# EAGLE design DRC10_2P4X1P65.pac (EAGLE 9.6.2)
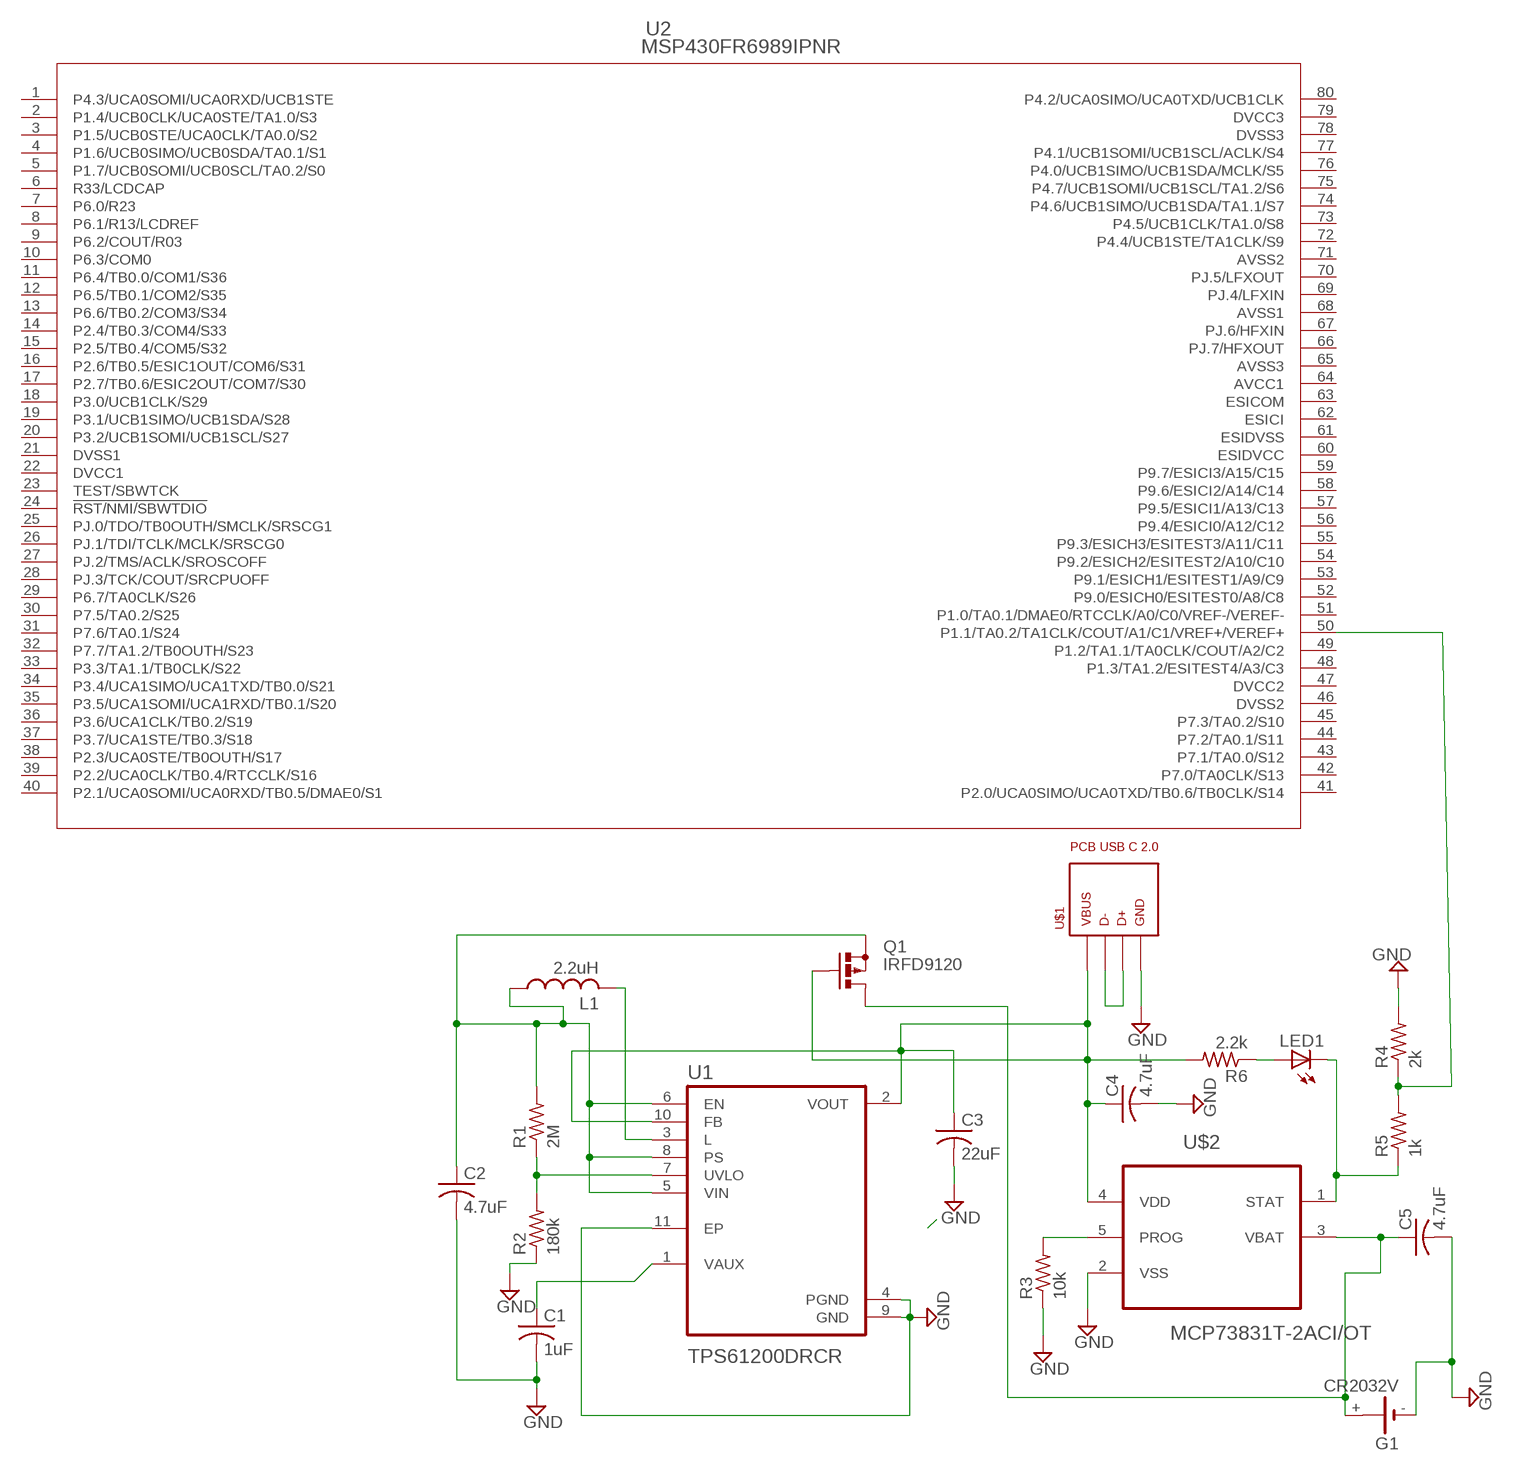
[diagram p0: schematic, sheet 1]

## Parts
C1  1uF  C-US150-072X183  [C150-072X183]
C2  4.7uF  C-US150-072X183  [C150-072X183]
C3  22uF  C-US150-072X183  [C150-072X183]
C4  4.7uF  C-US150-072X183  [C150-072X183]
C5  4.7uF  C-US150-072X183  [C150-072X183]
G1  CR2032V  [CR2032V]
L1  2.2uH  L-US0207/15  [0207/15]
LED1  LEDB155  [Q62902-B155]
Q1  IRFD9120  [C370-01]
R1  2M  R-US_0414/15  [0414/15]
R2  180k  R-US_0414/15  [0414/15]
R3  10k  R-US_0414/15  [0414/15]
R4  2k  R-US_0414/15  [0414/15]
R5  1k  R-US_0414/15  [0414/15]
R6  2.2k  R-US_0414/15  [0414/15]
U1  TPS61200DRCR  [VREG_V62/16624-01YE]
U2  MSP430FR6989IPNR  [PN80_TEX]
U$1  PCB_USB_C_2.0DS_1  [USB_TYPE_C_DS_1]
U$2  MCP73831T-2ACI/OT  [SOT95P280X145-5N]

## Nets
GND: C1.2 C2.2 C3.2 C4.2 C5.2 G1.- R2.1 R3.1 R4.2 U1.4(PGND) U1.9(GND) U1.11(EP) U$1.A1(GND) U$1.A12(GND) U$1.B1(GND) U$1.B12(GND) U$2.2(VSS)
N$1: R1.1 R2.2 U1.7(UVLO)
N$2: C3.1 C4.1 Q1.G R6.2 U1.2(VOUT) U1.10(FB) U$1.A4(VBUS) U$1.A9(VBUS) U$1.B4(VBUS) U$1.B9(VBUS) U$2.4(VDD)
N$3: C2.1 L1.1 Q1.S R1.2 U1.5(VIN) U1.6(EN) U1.8(PS)
N$4: C1.1 U1.1(VAUX)
N$5: L1.2 U1.3(L)
N$7: U$1.A6(D+) U$1.A7(D-) U$1.B6(D+) U$1.B7(D-)
N$8: R3.2 U$2.5(PROG)
N$9: LED1.K(C) R5.1 U$2.1(STAT)
N$11: R4.1 R5.2 U2.50(P1.1/TA0.2/TA1CLK/COUT/A1/C1/VREF+/VEREF+)
N$12: LED1.A R6.1
N$14: C5.1 G1.+ Q1.D Q1.D1(D) U$2.3(VBAT)
Unconnected: G1.+@1(+) U2.1(P4.3/UCA0SOMI/UCA0RXD/UCB1STE) U2.2(P1.4/UCB0CLK/UCA0STE/TA1.0/S3) U2.3(P1.5/UCB0STE/UCA0CLK/TA0.0/S2) U2.4(P1.6/UCB0SIMO/UCB0SDA/TA0.1/S1) U2.5(P1.7/UCB0SOMI/UCB0SCL/TA0.2/S0) U2.6(R33/LCDCAP) U2.7(P6.0/R23) U2.8(P6.1/R13/LCDREF) U2.9(P6.2/COUT/R03) U2.10(P6.3/COM0) U2.11(P6.4/TB0.0/COM1/S36) U2.12(P6.5/TB0.1/COM2/S35) U2.13(P6.6/TB0.2/COM3/S34) U2.14(P2.4/TB0.3/COM4/S33) U2.15(P2.5/TB0.4/COM5/S32) U2.16(P2.6/TB0.5/ESIC1OUT/COM6/S31) U2.17(P2.7/TB0.6/ESIC2OUT/COM7/S30) U2.18(P3.0/UCB1CLK/S29) U2.19(P3.1/UCB1SIMO/UCB1SDA/S28) U2.20(P3.2/UCB1SOMI/UCB1SCL/S27) U2.23(TEST/SBWTCK) U2.24(!RST/NMI/SBWTDIO) U2.25(PJ.0/TDO/TB0OUTH/SMCLK/SRSCG1) U2.26(PJ.1/TDI/TCLK/MCLK/SRSCG0) U2.27(PJ.2/TMS/ACLK/SROSCOFF) U2.28(PJ.3/TCK/COUT/SRCPUOFF) U2.29(P6.7/TA0CLK/S26) U2.30(P7.5/TA0.2/S25) U2.31(P7.6/TA0.1/S24) U2.32(P7.7/TA1.2/TB0OUTH/S23) U2.33(P3.3/TA1.1/TB0CLK/S22) U2.34(P3.4/UCA1SIMO/UCA1TXD/TB0.0/S21) U2.35(P3.5/UCA1SOMI/UCA1RXD/TB0.1/S20) U2.36(P3.6/UCA1CLK/TB0.2/S19) U2.37(P3.7/UCA1STE/TB0.3/S18) U2.38(P2.3/UCA0STE/TB0OUTH/S17) U2.39(P2.2/UCA0CLK/TB0.4/RTCCLK/S16) U2.40(P2.1/UCA0SOMI/UCA0RXD/TB0.5/DMAE0/S1) U2.41(P2.0/UCA0SIMO/UCA0TXD/TB0.6/TB0CLK/S14) U2.42(P7.0/TA0CLK/S13) U2.43(P7.1/TA0.0/S12) U2.44(P7.2/TA0.1/S11) U2.45(P7.3/TA0.2/S10) U2.48(P1.3/TA1.2/ESITEST4/A3/C3) U2.49(P1.2/TA1.1/TA0CLK/COUT/A2/C2) U2.51(P1.0/TA0.1/DMAE0/RTCCLK/A0/C0/VREF-/VEREF-) U2.52(P9.0/ESICH0/ESITEST0/A8/C8) U2.53(P9.1/ESICH1/ESITEST1/A9/C9) U2.54(P9.2/ESICH2/ESITEST2/A10/C10) U2.55(P9.3/ESICH3/ESITEST3/A11/C11) U2.56(P9.4/ESICI0/A12/C12) U2.57(P9.5/ESICI1/A13/C13) U2.58(P9.6/ESICI2/A14/C14) U2.59(P9.7/ESICI3/A15/C15) U2.62(ESICI) U2.63(ESICOM) U2.66(PJ.7/HFXOUT) U2.67(PJ.6/HFXIN) U2.69(PJ.4/LFXIN) U2.70(PJ.5/LFXOUT) U2.72(P4.4/UCB1STE/TA1CLK/S9) U2.73(P4.5/UCB1CLK/TA1.0/S8) U2.74(P4.6/UCB1SIMO/UCB1SDA/TA1.1/S7) U2.75(P4.7/UCB1SOMI/UCB1SCL/TA1.2/S6) U2.76(P4.0/UCB1SIMO/UCB1SDA/MCLK/S5) U2.77(P4.1/UCB1SOMI/UCB1SCL/ACLK/S4) U2.80(P4.2/UCA0SIMO/UCA0TXD/UCB1CLK)

## Power pins joined to a net without a drawn wire
AVCC1: U2.64(AVCC1)
AVSS1: U2.68(AVSS1)
AVSS2: U2.71(AVSS2)
AVSS3: U2.65(AVSS3)
DVCC1: U2.22(DVCC1)
DVCC2: U2.47(DVCC2)
DVCC3: U2.79(DVCC3)
DVSS1: U2.21(DVSS1)
DVSS2: U2.46(DVSS2)
DVSS3: U2.78(DVSS3)
ESIDVCC: U2.60(ESIDVCC)
ESIDVSS: U2.61(ESIDVSS)

## Library data of the parts
C1-C5 = adafruit:C-US: CAPACITOR, American symbol
G1 = battery:CR2032V: LI BATTERY Varta
L1 = rcl:L-US: INDUCTOR, American symbol; SPICEPREFIX: L
LED1 = adafruit:LED: LED OSRAM: - CHIPLED LG R971, LG N971, LY N971, LG Q971, LY Q971, LO R971, LY R971 LH N974, LH R974 LS Q976, LO Q976, LY Q976 LO Q996 - Hyper CHIPLED LW Q18S LB Q993, LB Q99A, LB R99A - SideLED LS A670, LO A670, LY A670, LG A670, LP A670 LB A673, LV A673, LT A673, LW A673 LH A674 LY A675 LS A676, LA A676, LO A676, LY A676, LW A676 LS A679, LY A679, LG A679 - Hyper Micro SIDELED® LS Y876, LA Y876, LO Y876, LY Y876 LT Y87S - SmartLED LW L88C, LW L88S LB L89C, LB L89S, LG L890 LS L89K, LO L89K, LY L89K LS L896, LA L896, LO L896, LY L896 - TOPLED LS T670, LO T670, LY T670, LG T670, LP T670 LSG T670, LSP T670, LSY T670, LOP T670, LYG T670 LG T671, LOG T671, LSG T671 LB T673, LV T673, LT T673, LW T673 LH T674 LS T676, LA T676, LO T676, LY T676, LB T676, LH T676, LSB T676, LW T676 LB T67C, LV T67C, LT T67C, LS T67K, LO T67K, LY T67K, LW E67C LS E67B, LA E67B, LO E67B, LY E67B, LB E67C, LV E67C, LT E67C LW T67C LS T679, LY T679, LG T679 LS T770, LO T770, LY T770, LG T770, LP T770 LB T773, LV T773, LT T773, LW T773 LH T774 LS E675, LA E675, LY E675, LS T675 LS T776, LA T776, LO T776, LY T776, LB T776 LHGB T686 LT T68C, LB T68C - Hyper Mini TOPLED® LB M676 - Mini TOPLED Santana® LG M470 LS M47K, LO M47K, LY M47K Source: http://www.osram.convergy.de/
Q1 = transistor-small-signal:IRFD9120: P-CHANNEL MOS FET
R1-R6 = adafruit:R-US_: RESISTOR, American symbol
U1 = TPS61200DRCR:TPS61200DRCR; AVAILABILITY: Unavailable; DESCRIPTION: 0.3V Input Voltage Boost Converter with 1.3A Switches and 'Down Mode' in 3x3 QFN 10-VSON -40 to 85; MF: Texas Instruments; MP: TPS61200DRCR; PACKAGE: VSON-10 Texas Instruments; PRICE: None; PURCHASE-URL: https://pricing.snapeda.com/search/part/TPS61200DRCR/?ref=eda
U2 = MSP430FR6989:MSP430FR6989IPNR; BUILT_BY: EMA_UL_Team; MANUFACTURER_PART_NUMBER: MSP430FR6989IPNR; SOURCELIBRARY: TI_2016-08-12; VENDOR: Texas Instruments
U$1 = USB_pcb_connectors:PCB_USB_C_2.0
U$2 = MCP73831T-2ACI_OT:MCP73831T-2ACI/OT: Charge Management Controller Check prices <https://pricing.snapeda.com/search/part/MCP73831T-2ACI/OT/?ref=eda>; AVAILABILITY: Good; DESCRIPTION: Charger IC Lithium Ion/Polymer SOT-23-5; MF: Microchip; MP: MCP73831T-2ACI/OT; PACKAGE: SOT-23 Microchip; PRICE: None; PURCHASE-URL: https://pricing.snapeda.com/search/part/MCP73831T-2ACI/OT/?ref=eda

## Board
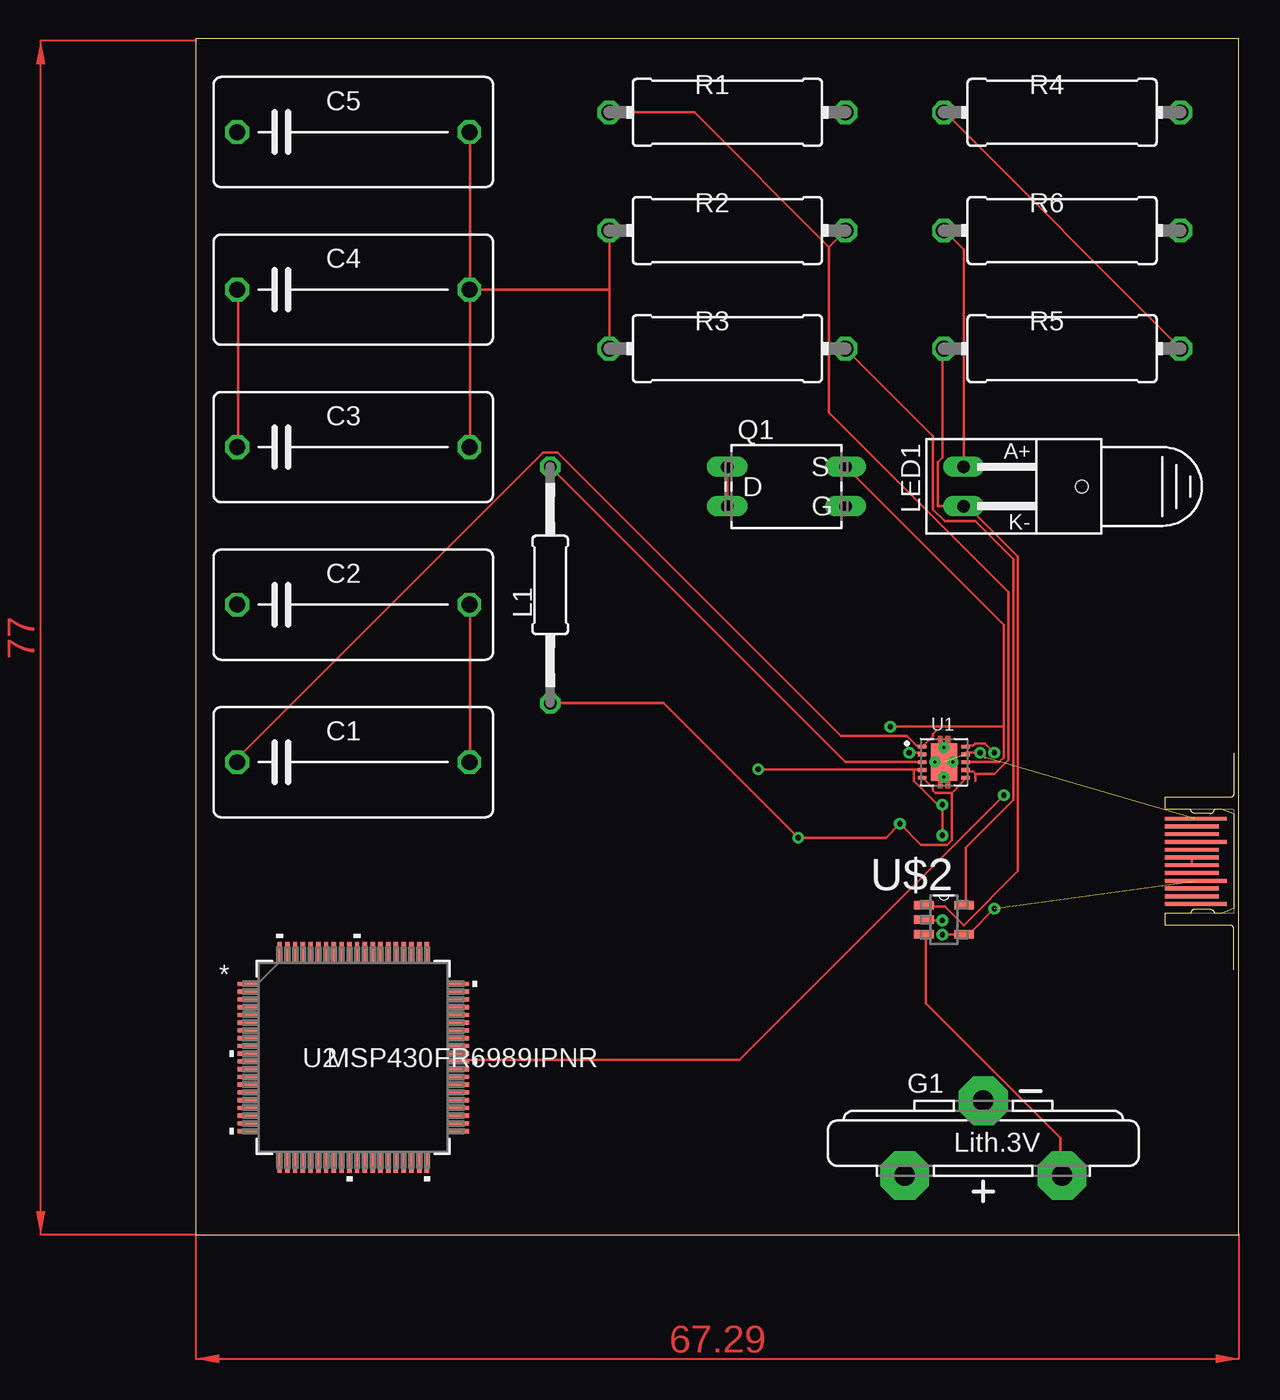
[diagram p1: board, top side]
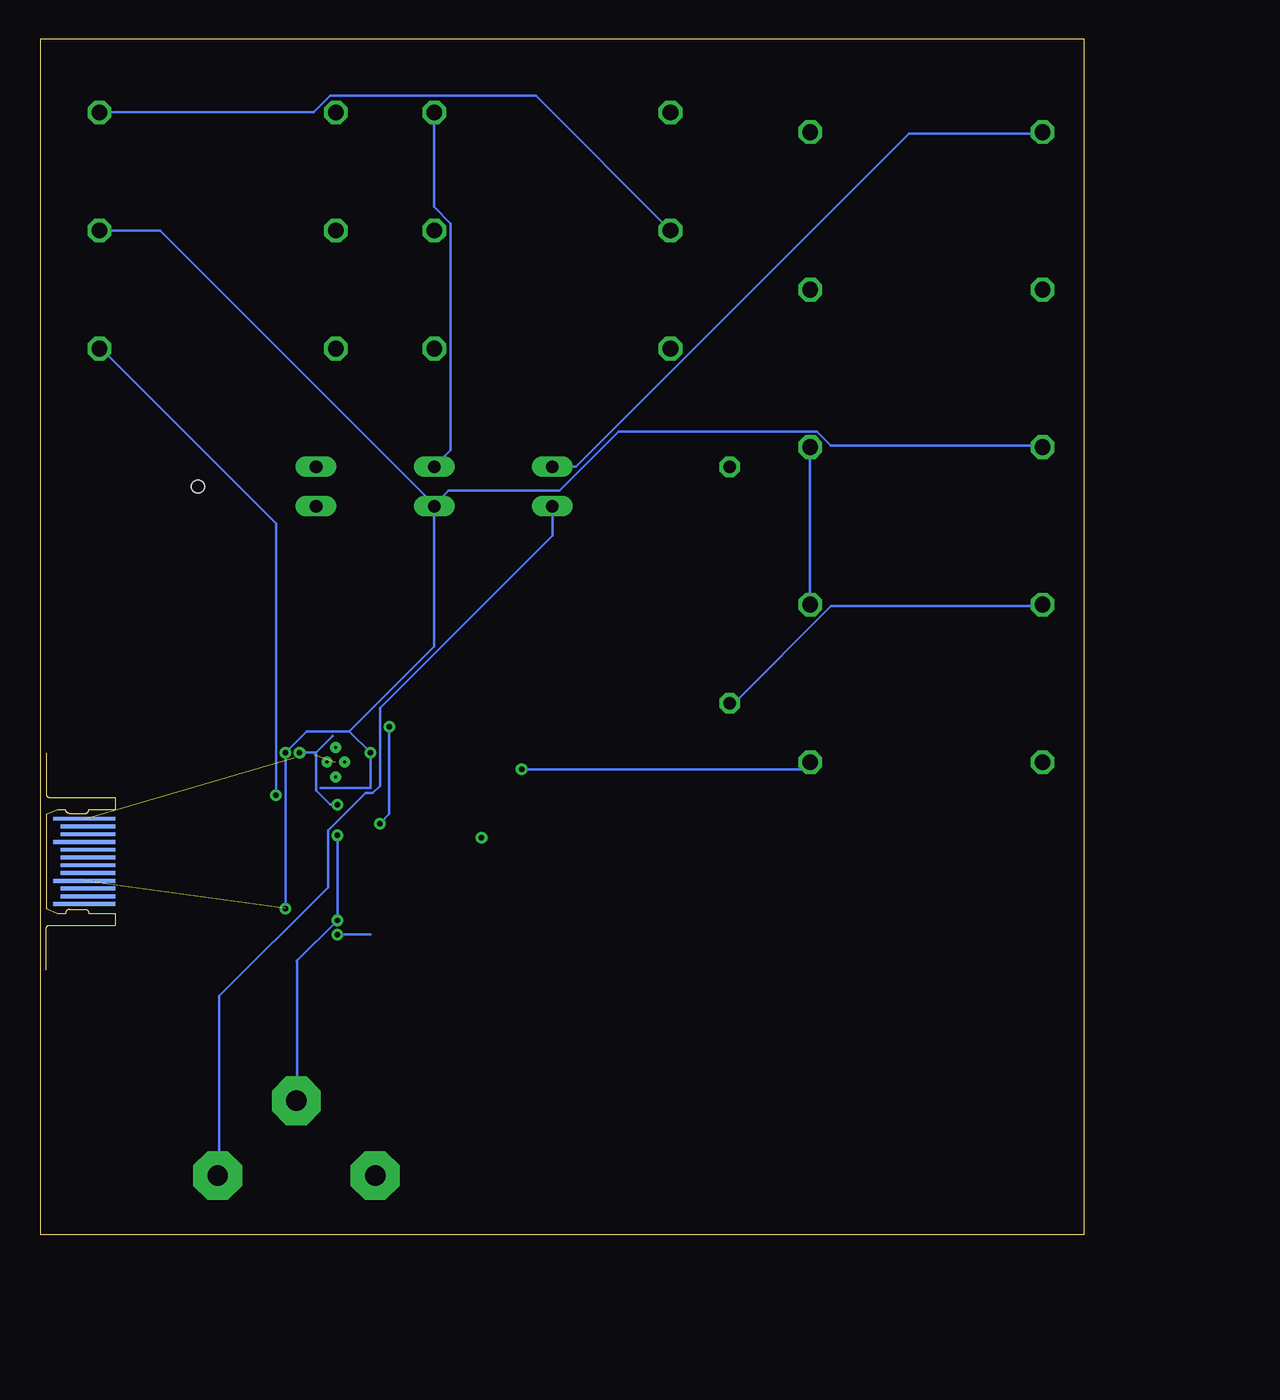
[diagram p2: board, bottom side, seen from below]

Size 67.29 x 77.14 mm. Coordinates in mm from the lower left corner, seen from the top.
Outline: 0,0 67.29,0 67.29,77.14 0,77.14 0,0
Copper layers (1*16): Top 0.035mm / dielectric 1.5mm / Bottom 0.035mm
Design rules "default": minimum track width 6mil, minimum drill 0.35mm, track to track 6mil, track to pad 6mil, pad to pad 6mil, via to via 6mil, smd to smd 6mil, copper to edge 40mil, drill to drill 6mil, minimum pad ring 10mil, minimum via ring 8mil, stop-mask expansion 4mil, vias tented up to drill 0mil, thermal gap 10mil

### Footprints (pad centres in the part's own frame; a part is rotated, then mirrored left to right if it is on the bottom)
C150-072X183 = drill 1.016 octagon: 1 -7.493,0; 2 7.493,0
CR2032V = drill 1.321 pad 3.15 octagon: + -2.54,-5.08; +@1 -2.54,5.08; - 2.286,0
0207/15 = drill 0.813 octagon: 1 -7.62,0; 2 7.62,0
Q62902-B155 = drill 0.813 long: A 7.62,-1.27; K 7.62,1.27 | hole 0.813: 0,0
C370-01 = drill 0.813 long: D -3.81,1.27; D1 -3.81,-1.27; G 3.81,-1.27; S 3.81,1.27
0414/15 = drill 1.016 octagon: 1 -7.62,0; 2 7.62,0
VREG_V62/16624-01YE = smd 0.6 x 0.24: 1 -1.4,1; 2 -1.4,0.5; 3 -1.4,0; 4 -1.4,-0.5; 5 -1.4,-1; 6 1.4,-1; 7 1.4,-0.5; 8 1.4,0; 9 1.4,0.5; 10 1.4,1 | smd 1.65 x 2.4: 11 0,0 | drill 0.2 pad 0.3: 12 0,-0.95; 13 -0.575,0; 14 0.575,0; 15 0,0.95
PN80_TEX = smd 1.359 x 0.279: 1 -6.775,4.75; 2 -6.775,4.25; 3 -6.775,3.75; 4 -6.775,3.25; 5 -6.775,2.75; 6 -6.775,2.25; 7 -6.775,1.75; 8 -6.775,1.25; 9 -6.775,0.75; 10 -6.775,0.25; 11 -6.775,-0.25; 12 -6.775,-0.75; 13 -6.775,-1.25; 14 -6.775,-1.75; 15 -6.775,-2.25; 16 -6.775,-2.75; 17 -6.775,-3.25; 18 -6.775,-3.75; 19 -6.775,-4.25; 20 -6.775,-4.75; 41 6.775,-4.75; 42 6.775,-4.25; 43 6.775,-3.75; 44 6.775,-3.25; 45 6.775,-2.75; 46 6.775,-2.25; 47 6.775,-1.75; 48 6.775,-1.25; 49 6.775,-0.75; 50 6.775,-0.25; 51 6.775,0.25; 52 6.775,0.75; 53 6.775,1.25; 54 6.775,1.75; 55 6.775,2.25; 56 6.775,2.75; 57 6.775,3.25; 58 6.775,3.75; 59 6.775,4.25; 60 6.775,4.75 | smd 0.279 x 1.359: 21 -4.75,-6.775; 22 -4.25,-6.775; 23 -3.75,-6.775; 24 -3.25,-6.775; 25 -2.75,-6.775; 26 -2.25,-6.775; 27 -1.75,-6.775; 28 -1.25,-6.775; 29 -0.75,-6.775; 30 -0.25,-6.775; 31 0.25,-6.775; 32 0.75,-6.775; 33 1.25,-6.775; 34 1.75,-6.775; 35 2.25,-6.775; 36 2.75,-6.775; 37 3.25,-6.775; 38 3.75,-6.775; 39 4.25,-6.775; 40 4.75,-6.775; 61 4.75,6.775; 62 4.25,6.775; 63 3.75,6.775; 64 3.25,6.775; 65 2.75,6.775; 66 2.25,6.775; 67 1.75,6.775; 68 1.25,6.775; 69 0.75,6.775; 70 0.25,6.775; 71 -0.25,6.775; 72 -0.75,6.775; 73 -1.25,6.775; 74 -1.75,6.775; 75 -2.25,6.775; 76 -2.75,6.775; 77 -3.25,6.775; 78 -3.75,6.775; 79 -4.25,6.775; 80 -4.75,6.775
USB_TYPE_C_DS_1 = smd 0.25 x 4: A1 2.75,-2.45; A4 1.25,-2.45; A9 -1.25,-2.45; A12 -2.75,-2.45 | smd 0.25 x 3.5: A2 2.25,-2.7; A3 1.75,-2.7; A5 0.75,-2.7; A6 0.25,-2.7; A7 -0.25,-2.7; A8 -0.75,-2.7; A10 -1.75,-2.7; A11 -2.25,-2.7 | smd 0.25 x 4 bottom: B1 -2.75,-2.45; B4 -1.25,-2.45; B9 1.25,-2.45; B12 2.75,-2.45 | smd 0.25 x 3.5 bottom: B2 -2.25,-2.7; B3 -1.75,-2.7; B5 -0.75,-2.7; B6 -0.25,-2.7; B7 0.25,-2.7; B8 0.75,-2.7; B10 1.75,-2.7; B11 2.25,-2.7
SOT95P280X145-5N = smd 1.27 x 0.559: 1 -1.295,0.94; 2 -1.295,0; 3 -1.295,-0.94; 4 1.295,-0.94; 5 1.295,0.94

### Placement (x,y rotation side)
C1  10.16,30.48 0 top
C2  10.16,40.64 0 top
C3  10.16,50.8 0 top
C4  10.16,60.96 0 top
C5  10.16,71.12 0 top
G1  50.8,6.35 90 top
L1  22.86,41.91 90 top
LED1  57.15,48.26 180 top
Q1  38.1,48.26 0 top
R1  34.29,72.39 0 top
R2  34.29,64.77 0 top
R3  34.29,57.15 0 top
R4  55.88,72.39 0 top
R5  55.88,57.15 0 top
R6  55.88,64.77 0 top
U1  48.26,30.48 0 top
U2  10.16,11.43 0 top
U$1  66.94,24.08 270 top
U$2  48.26,20.32 0 top

### Tracks (layer width: path | path; a pad name or v marks a point on that pad's centre or on a via)
GND  (via drill 0.35)  (2 unrouted)
  Top 0.152: v48.16,20.27 47.09,20.27 U$2.2 | 17.68,40.69 C2.2 17.68,40.54 17.68,30.48 C1.2 | 17.68,50.75 C3.2 17.68,50.9 17.68,60.96 | U1.9 49.68,31.09 v50.6,31.09 50.9,30.79 | 46.33,30.02 46.79,30.02 U1.4 | 46.33,30.02 v36.27,30.02 | v48.16,25.76 48.16,27.43 48.01,27.58 | 48.01,27.58 46.33,29.26 46.33,30.02 | 48.01,27.58 v48.16,27.74 | R2.1 26.67,60.96 | 26.67,60.96 R3.1 | 26.67,60.96 17.68,60.96 | 17.68,60.96 17.68,71.02 C5.2 | 17.68,60.96 C4.2
  Bottom 0.152: 50.8,17.63 50.75,17.68 | 50.75,17.68 v48.16,20.27 v48.16,25.76 | 18.14,30.02 17.68,30.48 C1.2 18.14,30.02 | 49.53,31.09 v50.6,31.09 | 48.46,32.16 49.53,31.09 | 49.53,31.09 49.53,28.65 48.62,27.74 v48.16,27.74 | 50.75,17.68 50.75,8.69 G1.- | R4.2 49.68,72.39 48.62,73.46 35.36,73.46 R2.1 | C3.2 17.68,50.75 17.68,40.69 C2.2 | 18.14,30.02 v36.27,30.02
N$1
  Top 0.152: 50.29,29.72 50.14,29.87 49.68,29.87 U1.7 | 50.29,29.26 50.29,29.72 | 50.29,29.72 51.51,29.72 52.43,30.63 52.43,41.45 40.84,53.03 40.84,63.7 | R2.2 40.84,63.7 | R1.1 32.16,72.39 40.84,63.7
N$2  (via drill 0.35)  (1 unrouted)
  Top 0.152: 63.55,64.77 R6.2 | v46.02,31.09 46.79,31.09 U1.2 | v51.51,31.09 50.9,31.7 50.29,31.7 50.14,31.55 49.68,31.55 U1.10 | v48.16,19.36 49.53,19.36 U$2.4 49.68,19.51 49.99,19.51 v51.51,21.03 | C3.1 2.74,50.9 2.74,60.96 C4.1
  Bottom 0.152: 49.23,28.8 46.02,28.8 v46.02,31.09 47.4,32.46 | 46.02,19.36 v48.16,19.36 | 2.74,50.75 C3.1 2.74,50.9 16.31,50.9 17.22,51.82 30.02,51.82 33.83,48.01 41,48.01 41.91,47.09 | 47.4,32.46 50.14,32.46 v51.51,31.09 v51.51,21.03 | 47.4,32.46 41.91,37.95 Q1.G 41.91,47.09 | R6.2 59.59,64.77 41.91,47.09
N$3  (via drill 0.35)
  Top 0.152: 48.77,28.5 47.7,28.5 47.55,28.65 47.55,28.8 46.94,29.41 U1.5 | 48.77,28.5 49.68,29.41 U1.6 | 2.74,40.54 C2.1 | U1.8 51.82,30.48 52.12,30.79 52.12,32.77 | 52.12,32.77 52.12,39.32 Q1.S | 48.77,28.5 48.77,25.45 48.46,25.15 46.79,25.15 v45.41,26.52 44.5,25.6 v38.86,25.6 30.18,34.29 L1.1 | v44.81,32.77 52.12,32.77
  Bottom 0.152: R1.2 41.91,66.29 40.84,65.23 40.84,50.6 Q1.S | L1.1 22.55,34.29 16.31,40.54 2.74,40.54 C2.1 | v44.81,32.77 44.81,27.13 v45.41,26.52
N$4
  Top 0.152: 47.7,32.46 47.55,32.31 47.55,32.16 46.94,31.55 U1.1 46.79,31.55 46.48,31.55 45.87,32.16 41.6,32.16 23.32,50.44 22.4,50.44 2.74,30.79 2.74,30.48 C1.1
N$5
  Top 0.152: U1.3 41.91,30.48 L1.2
N$7
  Top 0.152: U$1.A7 U$1.B7
N$8
  Top 0.152: R3.2 47.55,51.51 47.55,46.79 48.31,46.02 50.29,46.02 52.73,43.59 52.73,28.04 49.68,24.99 49.68,21.34 U$2.5
N$9
  Top 0.152: U$2.1 47.09,21.18 48.31,21.18 49.53,19.96 53.03,23.47 53.03,43.74 49.84,46.94 49.53,46.94 LED1.K 47.85,46.99 47.85,49.84 48.16,50.14 48.16,57.15 R5.1
N$11  (via drill 0.35)
  Top 0.152: 16.97,11.12 U2.50 17.07,11.28 35.05,11.28 v52.12,28.35 | 63.4,57.15 R5.2 63.55,57.15 48.31,72.39 R4.1
  Bottom 0.152: v52.12,28.35 52.12,45.87 63.4,57.15 R5.2
N$12
  Top 0.152: LED1.A 49.53,63.55 48.31,64.77 R6.1
N$14
  Top 0.152: 46.94,19.36 U$2.3 47.09,19.36 47.09,14.94 55.78,6.25 55.78,3.81 G1.+ | Q1.D Q1.D1
  Bottom 0.152: Q1.D 32.77,49.53 11.28,71.02 2.74,71.02 C5.1 | Q1.D1 34.29,45.11 45.41,33.98 45.41,28.96 45.87,28.5 46.33,28.5 48.77,26.06 48.77,22.4 55.78,15.39 55.78,3.81 G1.+
(copper drawn outside any net)
  shapes: Top area x2